# Altium schematic sheet FxxZx.SchDoc
size A2
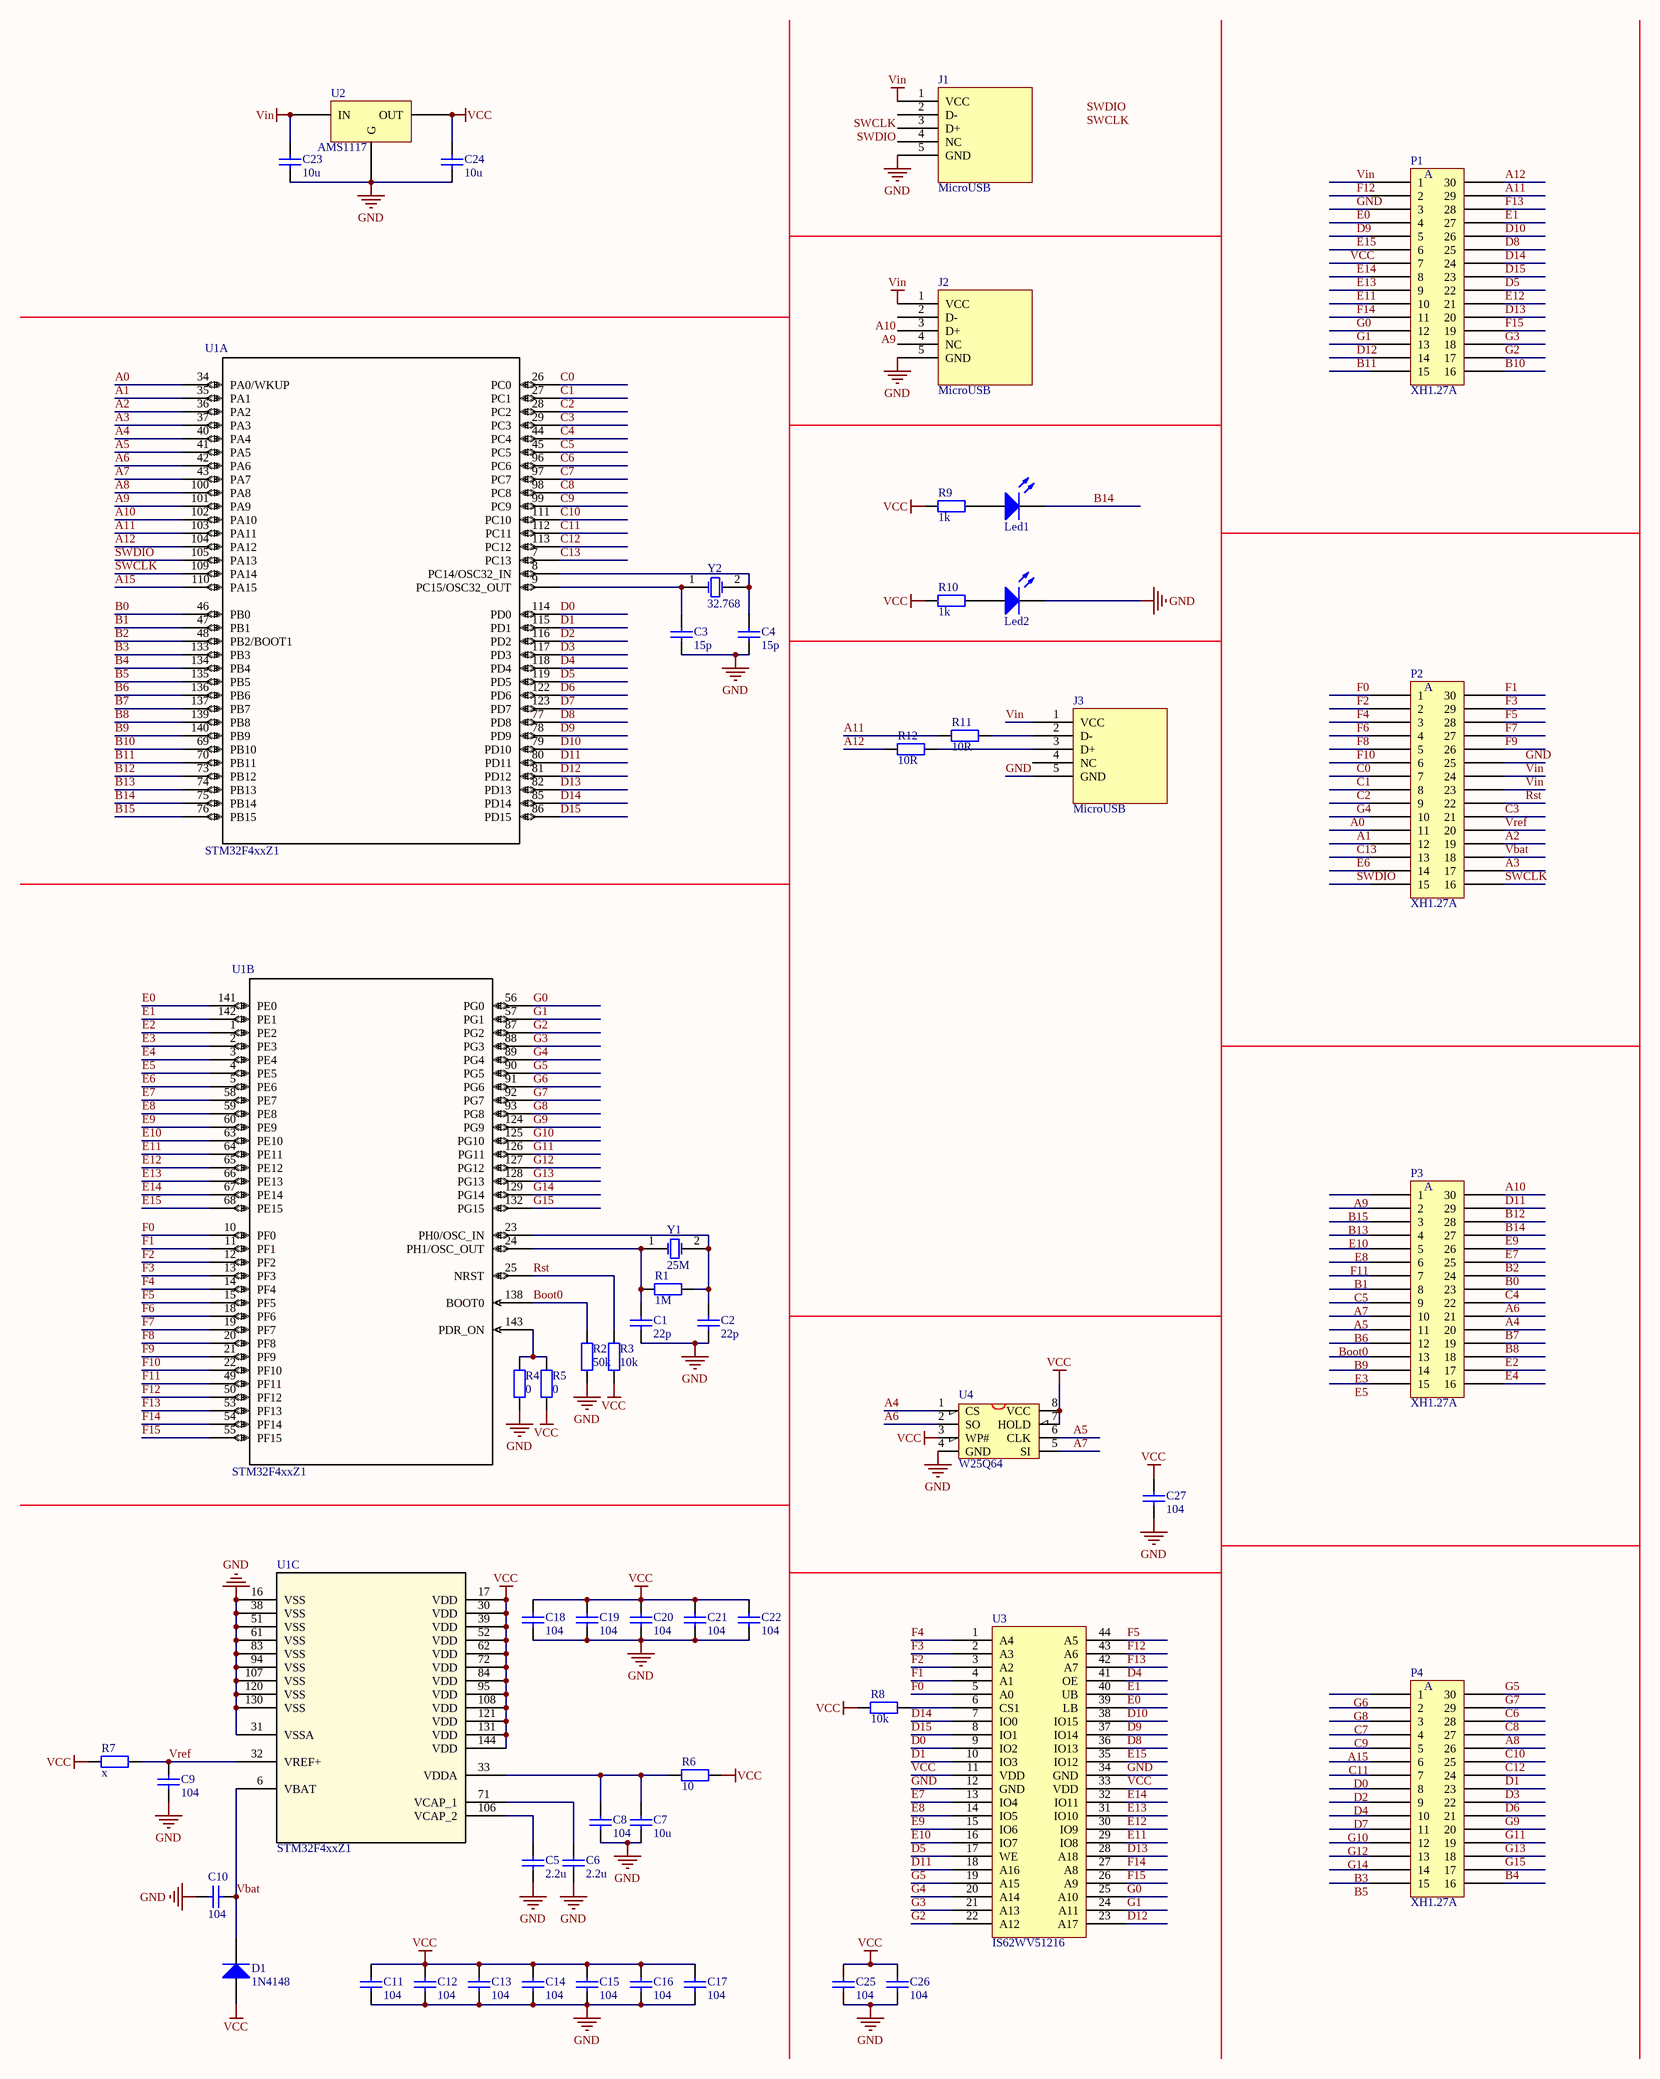
[diagram p0: FxxZx.SchDoc]

## Parts
C1  22p  [0603]
C2  22p  [0603]
C3  15p  [0603]
C4  15p  [0603]
C5  2.2u  [0603]
C6  2.2u  [0603]
C7  10u  [0603]
C8  104  [0603]
C9  104  [0603]
C10  104  [0603]
C11  104  [0603]
C12  104  [0603]
C13  104  [0603]
C14  104  [0603]
C15  104  [0603]
C16  104  [0603]
C17  104  [0603]
C18  104  [0603]
C19  104  [0603]
C20  104  [0603]
C21  104  [0603]
C22  104  [0603]
C23  10u  [0805]
C24  10u  [0805]
C25  104  [0603]
C26  104  [0603]
C27  104  [0603]
D1  1N4148  [0603]
J1  MicroUSB  [USB/SM0.8-6H5]
J2  MicroUSB  [USB/SM0.8-6H5]
J3  MicroUSB  [USB/SM0.8-6H5]
Led1  Red  [0805]  (value not drawn)
Led2  Red  [0805]  (value not drawn)
P1  XH1.27A  [XH1.27A]
P2  XH1.27A  [XH1.27A]
P3  XH1.27A  [XH1.27A]
P4  XH1.27A  [XH1.27A]
R1  1M  [0603]
R2  50k  [0603]
R3  10k  [0603]
R4  0  [0603]
R5  0  [0603]
R6  10  [0603]
R7  x  [0603]
R8  10k  [0603]
R9  1k  [0603]
R10  1k  [0603]
R11  10R  [0603]
R12  10R  [0603]
U1  STM32F4xxZ1  [LQFP144-20x20mm]  (parts A,B,C of 3)
U2  AMS1117  [SOT-89]
U3  IS62WV51216  [tsop-44]
U4  W25Q64  [SOIC-8]
Y1  25M  [3225-4]
Y2  32.768  [3215-2]

## Nets
GND: C1.1 C2.1 C3.1 C4.1 C5.1 C6.1 C7.1 C8.1 C9.1 C10.1 C11.1 C12.1 C13.1 C14.1 C15.1 C16.1 C17.1 C18.1 C19.1 C20.1 C21.1 C22.1 C23.1 C24.1 C25.1 C26.1 C27.1 J1.5(GND) J2.5(GND) J3.5(GND) Led2.2(K) P1.3 P2.25 R2.1 R4.1 U1.16(VSS) U1.31(VSSA) U1.38(VSS) U1.51(VSS) U1.61(VSS) U1.83(VSS) U1.94(VSS) U1.107(VSS) U1.120(VSS) U1.130(VSS) U2.1(G) U3.12(GND) U3.34(GND) U4.4(GND)
VCC: C11.2 C12.2 C13.2 C14.2 C15.2 C16.2 C17.2 C18.2 C19.2 C20.2 C21.2 C22.2 C24.2 C25.2 C26.2 C27.2 D1.1(A) P1.7 R3.1 R5.1 R6.1 R7.2 R8.2 R9.2 R10.2 U1.17(VDD) U1.30(VDD) U1.39(VDD) U1.52(VDD) U1.62(VDD) U1.72(VDD) U1.84(VDD) U1.95(VDD) U1.108(VDD) U1.121(VDD) U1.131(VDD) U1.144(VDD) U2.2(OUT) U3.11(VDD) U3.33(VDD) U4.3(WP#) U4.7(HOLD) U4.8(VCC)
Vin: C23.2 J1.1(VCC) J2.1(VCC) J3.1(VCC) P1.1 P2.23 P2.24 U2.3(IN)
A0: P2.11 U1.34(PA0/WKUP)
A1: P2.12 U1.35(PA1)
A2: P2.19 U1.36(PA2)
A3: P2.17 U1.37(PA3)
A4: P3.20 U1.40(PA4) U4.1(CS)
A5: P3.10 U1.41(PA5) U4.6(CLK)
A6: P3.21 U1.42(PA6) U4.2(SO)
A7: P3.9 U1.43(PA7) U4.5(SI)
A8: P4.26 U1.100(PA8)
A9: J2.3(D+) P3.1 U1.101(PA9)
A10: J2.2(D-) P3.30 U1.102(PA10)
A11: P1.29 R11.2 U1.103(PA11)
A12: P1.30 R12.2 U1.104(PA12)
A15: P4.5 U1.110(PA15)
B0: P3.23 U1.46(PB0)
B1: P3.7 U1.47(PB1)
B2: P3.24 U1.48(PB2/BOOT1)
B3: P4.14 U1.133(PB3)
B4: P4.16 U1.134(PB4)
B5: P4.15 U1.135(PB5)
B6: P3.11 U1.136(PB6)
B7: P3.19 U1.137(PB7)
B8: P3.18 U1.139(PB8)
B9: P3.13 U1.140(PB9)
B10: P1.16 U1.69(PB10)
B11: P1.15 U1.70(PB11)
B12: P3.28 U1.73(PB12)
B13: P3.3 U1.74(PB13)
B14: Led1.2(K) P3.27 U1.75(PB14)
B15: P3.2 U1.76(PB15)
Boot0: P3.12 R2.2 U1.138(BOOT0)
C0: P2.7 U1.26(PC0)
C1: P2.8 U1.27(PC1)
C2: P2.9 U1.28(PC2)
C3: P2.21 U1.29(PC3)
C4: P3.22 U1.44(PC4)
C5: P3.8 U1.45(PC5)
C6: P4.28 U1.96(PC6)
C7: P4.3 U1.97(PC7)
C8: P4.27 U1.98(PC8)
C9: P4.4 U1.99(PC9)
C10: P4.25 U1.111(PC10)
C11: P4.6 U1.112(PC11)
C12: P4.24 U1.113(PC12)
C13: P2.13 U1.7(PC13)
D0: P4.7 U1.114(PD0) U3.9(IO2)
D1: P4.23 U1.115(PD1) U3.10(IO3)
D2: P4.8 U1.116(PD2)
D3: P4.22 U1.117(PD3)
D4: P4.9 U1.118(PD4) U3.41(OE)
D5: P1.22 U1.119(PD5) U3.17(WE)
D6: P4.21 U1.122(PD6)
D7: P4.10 U1.123(PD7)
D8: P1.25 U1.77(PD8) U3.36(IO13)
D9: P1.5 U1.78(PD9) U3.37(IO14)
D10: P1.26 U1.79(PD10) U3.38(IO15)
D11: P3.29 U1.80(PD11) U3.18(A16)
D12: P1.14 U1.81(PD12) U3.23(A17)
D13: P1.20 U1.82(PD13) U3.28(A18)
D14: P1.24 U1.85(PD14) U3.7(IO0)
D15: P1.23 U1.86(PD15) U3.8(IO1)
E0: P1.4 U1.141(PE0) U3.39(LB)
E1: P1.27 U1.142(PE1) U3.40(UB)
E2: P3.17 U1.1(PE2)
E3: P3.14 U1.2(PE3)
E4: P3.16 U1.3(PE4)
E5: P3.15 U1.4(PE5)
E6: P2.14 U1.5(PE6)
E7: P3.25 U1.58(PE7) U3.13(IO4)
E8: P3.5 U1.59(PE8) U3.14(IO5)
E9: P3.26 U1.60(PE9) U3.15(IO6)
E10: P3.4 U1.63(PE10) U3.16(IO7)
E11: P1.10 U1.64(PE11) U3.29(IO8)
E12: P1.21 U1.65(PE12) U3.30(IO9)
E13: P1.9 U1.66(PE13) U3.31(IO10)
E14: P1.8 U1.67(PE14) U3.32(IO11)
E15: P1.6 U1.68(PE15) U3.35(IO12)
F0: P2.1 U1.10(PF0) U3.5(A0)
F1: P2.30 U1.11(PF1) U3.4(A1)
F2: P2.2 U1.12(PF2) U3.3(A2)
F3: P2.29 U1.13(PF3) U3.2(A3)
F4: P2.3 U1.14(PF4) U3.1(A4)
F5: P2.28 U1.15(PF5) U3.44(A5)
F6: P2.4 U1.18(PF6)
F7: P2.27 U1.19(PF7)
F8: P2.5 U1.20(PF8)
F9: P2.26 U1.21(PF9)
F10: P2.6 U1.22(PF10)
F11: P3.6 U1.49(PF11)
F12: P1.2 U1.50(PF12) U3.43(A6)
F13: P1.28 U1.53(PF13) U3.42(A7)
F14: P1.11 U1.54(PF14) U3.27(A8)
F15: P1.19 U1.55(PF15) U3.26(A9)
G0: P1.12 U1.56(PG0) U3.25(A10)
G1: P1.13 U1.57(PG1) U3.24(A11)
G2: P1.17 U1.87(PG2) U3.22(A12)
G3: P1.18 U1.88(PG3) U3.21(A13)
G4: P2.10 U1.89(PG4) U3.20(A14)
G5: P4.30 U1.90(PG5) U3.19(A15)
G6: P4.1 U1.91(PG6)
G7: P4.29 U1.92(PG7)
G8: P4.2 U1.93(PG8)
G9: P4.20 U1.124(PG9)
G10: P4.11 U1.125(PG10)
G11: P4.19 U1.126(PG11)
G12: P4.12 U1.127(PG12)
G13: P4.18 U1.128(PG13)
G14: P4.13 U1.129(PG14)
G15: P4.17 U1.132(PG15)
Rst: P2.22 R3.2 U1.25(NRST)
SWCLK: J1.2(D-) P2.16 U1.109(PA14)
SWDIO: J1.3(D+) P2.15 U1.105(PA13)
Vbat: C10.2 D1.2(K) P2.18 U1.6(VBAT)
Vref: C9.2 P2.20 R7.1 U1.32(VREF+)
NetC1_2: C1.2 R1.1 U1.24(PH1/OSC_OUT) Y1.1(OSC1)
NetC2_2: C2.2 R1.2 U1.23(PH0/OSC_IN) Y1.2(OSC2)
NetC3_2: C3.2 U1.9(PC15/OSC32_OUT) Y2.1(OSC1)
NetC4_2: C4.2 U1.8(PC14/OSC32_IN) Y2.2(OSC2)
NetC5_2: C5.2 U1.106(VCAP_2)
NetC6_2: C6.2 U1.71(VCAP_1)
NetC7_2: C7.2 C8.2 R6.2 U1.33(VDDA)
NetJ3_2: J3.2(D-) R11.1
NetJ3_3: J3.3(D+) R12.1
NetLed1_1: Led1.1(A) R9.1
NetLed2_1: Led2.1(A) R10.1
NetR4_2: R4.2 R5.2 U1.143(PDR_ON)
NetR8_1: R8.1 U3.6(CS1)

Not connected (* = marked no-connect by the designer): J1 4(NC); J2 4(NC); J3 4(NC)

## Notes on the sheet
- Labels drawn without touching a wire or pin: SWCLK, SWDIO
- Title
- Size:
- Date:
- File:
- A2
- Number:
- Time:
- Revision:
- Sheet
- of
- (in symbol XH1.27A) A

## Library data of the parts
C1-C27 = C: Capacitor; Published: 8-Jun-2000; LatestRevisionDate: 17-Jul-2002; LatestRevisionNote: Re-released for DXP Platform.; PackageReference: RAD-0.3; Publisher: Altium Limited; PackageDescription: Radial Cap, Thru-Hole; 2 Leads; 0.3 in Pin Spacing
D1 = D: Diode; Published: 8-Jun-2000; LatestRevisionDate: 17-Jul-2002; LatestRevisionNote: Re-released for DXP Platform.; PackageVersion: Sep-1996; PackageReference: SMC; Publisher: Altium Limited; PackageDescription: DO-214-AB/SMC; 2 C-Bend Leads; Body 7.9 x 5.9 mm, inc. leads (LxW); Code_JEDEC: DO-214-AB
Led1 Led2 = LED: Published: 8-Jun-2000; LatestRevisionDate: 08-Jul-2005; LatestRevisionNote: Mech Layer 1 removed.; PackageReference: LED-0; Publisher: Altium Limited; PackageDescription: LED; 2 Leads
R1-R12 = R: Resistor; Published: 8-Jun-2000; LatestRevisionDate: 17-Jul-2002; LatestRevisionNote: Re-released for DXP Platform.; PackageReference: AXIAL-0.4; Publisher: Altium Limited; PackageDescription: Axial Device, Thru-Hole; 2 Leads; 0.4 in Pin Spacing
U1 = STM32F4xxZ1: Imported; Vendor: STMicroelectronics; C: Copyright (C) 2016 Accelerated Designs. All rights reserved; Manufacturer_Part_Number: stm32f4xxz1; Copyright: Copyright (C) 2016 Accelerated Designs. All rights reserved; RefDes: RefDes; Type: Type; Value: Value
U4 = W25X16: W25X16;SST25VF016;MX25L1605
Y1 = XTAL: Crystal Oscillator; pin to pad: 2>3; Published: 8-Jun-2000; LatestRevisionDate: 17-Jul-2002; LatestRevisionNote: Re-released for DXP Platform.; Publisher: Altium Limited
Y2 = XTAL: Crystal Oscillator; Published: 8-Jun-2000; LatestRevisionDate: 17-Jul-2002; LatestRevisionNote: Re-released for DXP Platform.; Publisher: Altium Limited